# EAGLE design Spectrometer-Board (EAGLE 8.4.1)
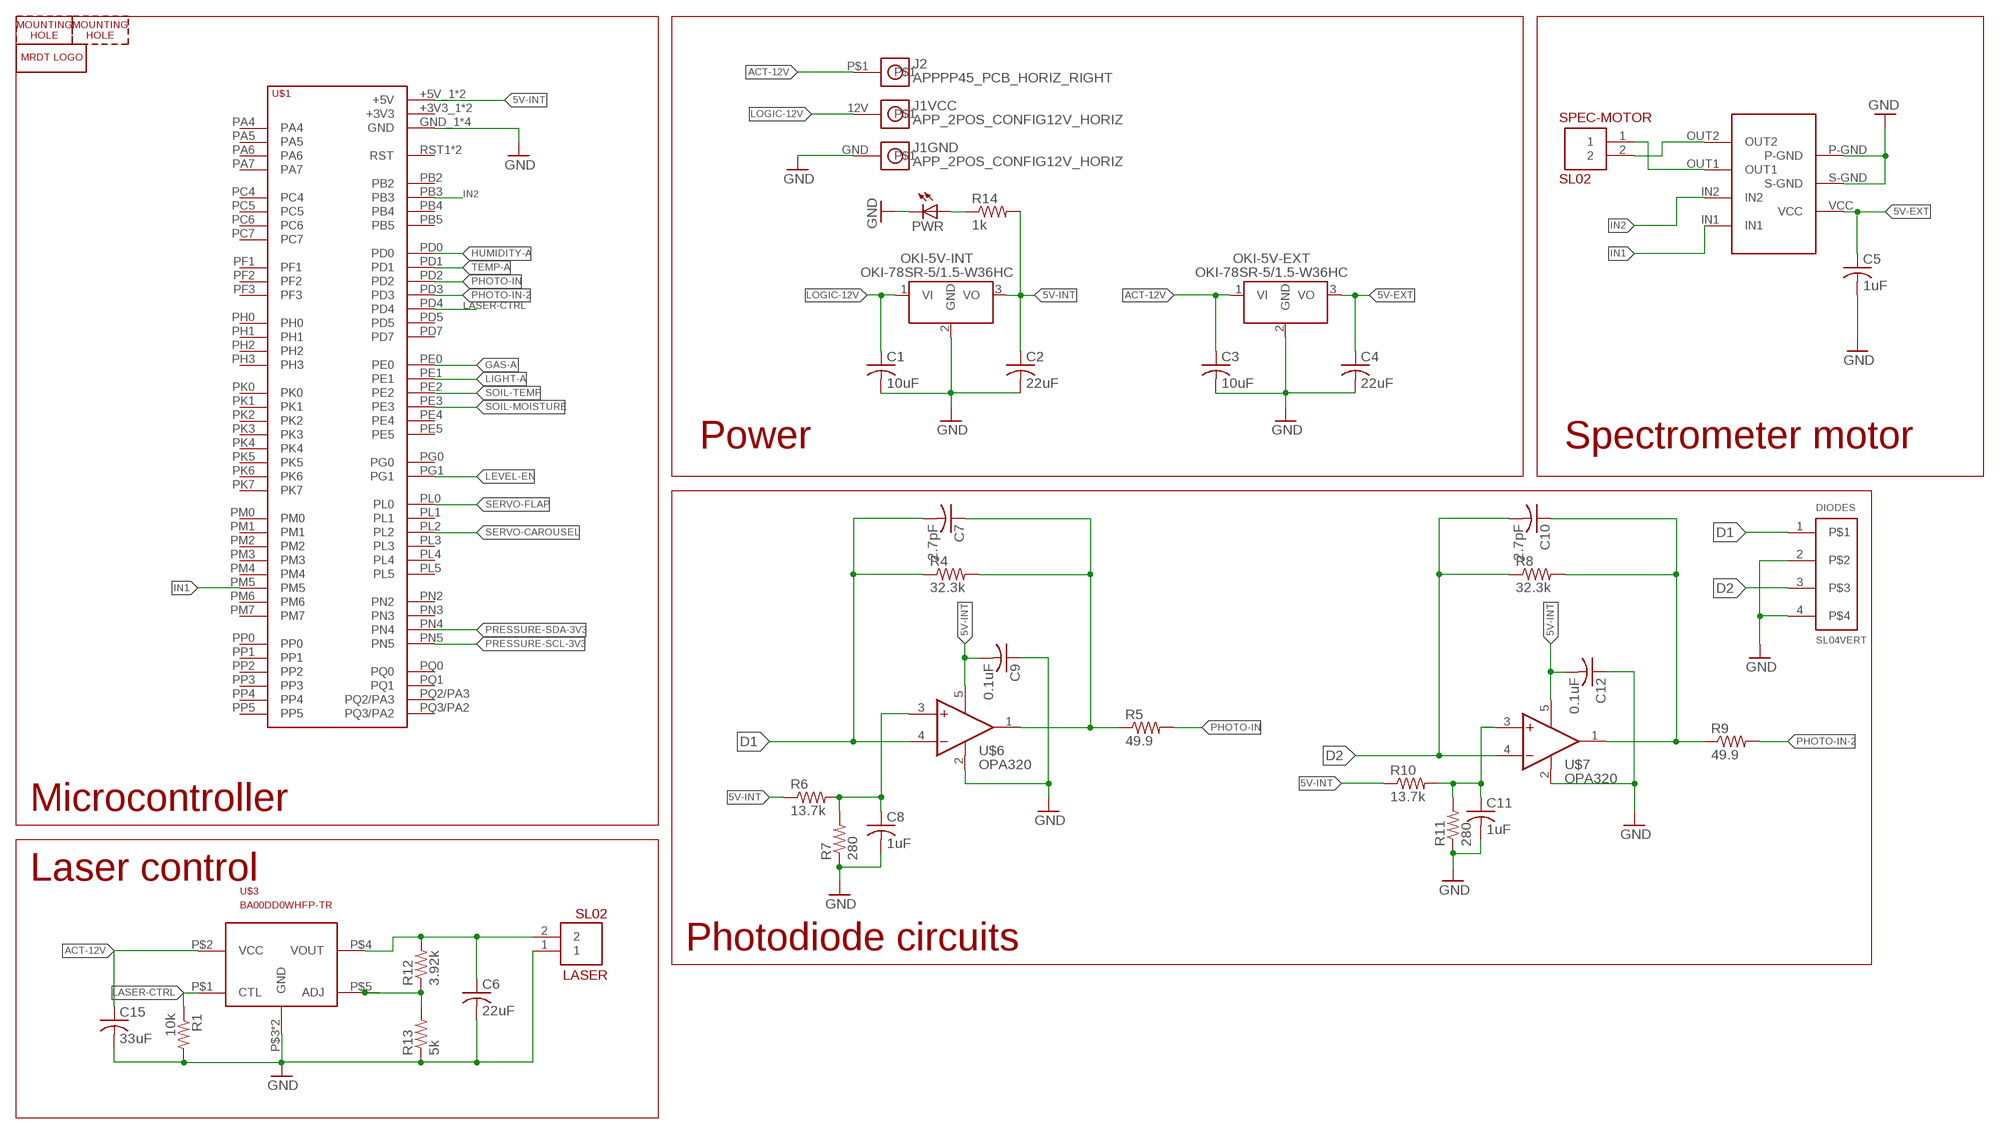
[diagram p0: schematic, sheet 1]

## Parts
C1  10uF  C-USC0805  [C0805]
C2  22uF  C-USC0805  [C0805]
C3  10uF  C-USC0805  [C0805]
C4  22uF  C-USC0805  [C0805]
C5  1uF  C-USC0805  [C0805]
C6  22uF  C-USC0805  [C0805]
C7  2.7pF  C-USC0805  [C0805]
C8  1uF  C-USC0805  [C0805]
C9  0.1uF  C-USC0805  [C0805]
C10  2.7pF  C-USC0805  [C0805]
C11  1uF  C-USC0805  [C0805]
C12  0.1uF  C-USC0805  [C0805]
C15  33uF  C-USC0805  [C0805]
DIODES  SL04VERT  [MOLEX-70543-0003]
H3  MOUNTING_HOLE#6  [#6_SCREW]
H4  MOUNTING_HOLE#6  [#6_SCREW]
J1  APP_2POS_CONFIG12V_HORIZ  [APP45_12V_HORIZ_CONFIG]
J2  APPPP45_PCB_HORIZ_RIGHT  [APP45_PCB_HORIZ_RIGHT]
LASER  SL02  [MOLEX-70543-0001]
LOGO1  MRDT_LOGO  [MRDT_LOGO]
OKI-5V-EXT  OKI-78SR-5/1.5-W36HC  [OKI-78SR_HORIZ]
OKI-5V-INT  OKI-78SR-5/1.5-W36HC  [OKI-78SR_HORIZ]
PWR  LEDCHIP-LED0805  [CHIP-LED0805]
R1  10k  R-US_M0805  [M0805]
R4  32.3k  R-US_M0805  [M0805]
R5  49.9  R-US_M0805  [M0805]
R6  13.7k  R-US_M0805  [M0805]
R7  280  R-US_M0805  [M0805]
R8  32.3k  R-US_M0805  [M0805]
R9  49.9  R-US_M0805  [M0805]
R10  13.7k  R-US_M0805  [M0805]
R11  280  R-US_M0805  [M0805]
R12  3.92k  R-US_M0805  [M0805]
R13  5k  R-US_M0805  [M0805]
R14  1k  R-US_M0805  [M0805]
SPEC-MOTOR  SL02  [MOLEX-70543-0001]
U$1  TIVA-1294  [TIVA-C-CONNECTED]
U$3  BA00DD0WHFP-TR  [TO-263-6]
U$6  OPA320  [SOT-23-5]
U$7  OPA320  [SOT-23-5]
U$10  LB1930MC  [SOIC10]

## Nets
5V-EXT: C4.1 C5.1 OKI-5V-EXT.3(VO) U$10.VCC
5V-INT: C2.1 C9.2 C12.2 OKI-5V-INT.3(VO) R6.1 R10.1 R14.2 U$1.+5V_1(+5V) U$1.+5V_2(+5V) U$6.5(OFF1) U$7.5(OFF1)
ACT-12V: C3.1 C15.1 J2.P$1 OKI-5V-EXT.1(VI) U$3.P$2(VCC)
D1: C7.2 DIODES.1 R4.1 U$6.4(-IN)
D2: C10.2 DIODES.3 R8.1 U$7.4(-IN)
GAS-A: U$1.PE0
GND: C1.2 C2.2 C3.2 C4.2 C5.2 C6.2 C8.2 C9.1 C11.2 C12.1 C15.2 DIODES.2 DIODES.4 J1.GND LASER.1 OKI-5V-EXT.2(GND) OKI-5V-INT.2(GND) PWR.C R1.2 R7.1 R11.1 R13.1 U$1.GND_1(GND) U$1.GND_2(GND) U$1.GND_3(GND) U$1.GND_4(GND) U$3.P$3(GND) U$3.P$6(GND) U$6.2(OFF2) U$7.2(OFF2) U$10.P-GND U$10.S-GND
HUMIDITY-A: U$1.PD0
IN1: U$1.PM5 U$10.IN1
IN2: U$1.PB3 U$10.IN2
LASER-CTRL: R1.1 U$1.PD4 U$3.P$1(CTL)
LEVEL-EN: U$1.PG1
LIGHT-A: U$1.PE1
LOGIC-12V: C1.1 J1.12V OKI-5V-INT.1(VI)
N$1: SPEC-MOTOR.2 U$10.OUT2
N$2: SPEC-MOTOR.1 U$10.OUT1
N$3: C6.1 LASER.2 R12.2 U$3.P$4(VOUT)
N$8: C7.1 R4.2 R5.1 U$6.1(OUT)
N$10: C8.1 R6.2 R7.2 U$6.3(+IN)
N$13: C10.1 R8.2 R9.1 U$7.1(OUT)
N$14: C11.1 R10.2 R11.2 U$7.3(+IN)
N$20: PWR.A R14.1
N$25: R12.1 R13.2 U$3.P$5(ADJ)
PHOTO-IN: R5.2 U$1.PD2
PHOTO-IN-2: R9.2 U$1.PD3
PRESSURE-SCL-3V3: U$1.PN5
PRESSURE-SDA-3V3: U$1.PN4
SERVO-CAROUSEL: U$1.PL2
SERVO-FLAP: U$1.PL0
SOIL-MOISTURE: U$1.PE3
SOIL-TEMP: U$1.PE2
TEMP-A: U$1.PD1
Unconnected: U$1.+3V3_1(+3V3) U$1.+3V3_2(+3V3) U$1.PA4 U$1.PA5 U$1.PA6 U$1.PA7 U$1.PB2 U$1.PB4 U$1.PB5 U$1.PC4 U$1.PC5 U$1.PC6 U$1.PC7 U$1.PD5 U$1.PD7 U$1.PE4 U$1.PE5 U$1.PF1 U$1.PF2 U$1.PF3 U$1.PG0 U$1.PH0 U$1.PH1 U$1.PH2 U$1.PH3 U$1.PK0 U$1.PK1 U$1.PK2 U$1.PK3 U$1.PK4 U$1.PK5 U$1.PK6 U$1.PK7 U$1.PL1 U$1.PL3 U$1.PL4 U$1.PL5 U$1.PM0 U$1.PM1 U$1.PM2 U$1.PM3 U$1.PM4 U$1.PM6 U$1.PM7 U$1.PN2 U$1.PN3 U$1.PP0 U$1.PP1 U$1.PP2 U$1.PP3 U$1.PP4 U$1.PP5 U$1.PQ0 U$1.PQ1 U$1.PQ2/PA3 U$1.PQ3/PA2 U$1.RST1(RST) U$1.RST_2(RST)

## Notes on the sheet
- Power | Spectrometer motor
- Microcontroller
- Laser control
- Photodiode circuits

## Library data of the parts
C1-C12 C15 = rcl:C-US: CAPACITOR, American symbol
DIODES = MRDT-Connectors:SL04
H3 H4 = MRDT-Hardware:MOUNTING_HOLE: Mounting hole for M6 bolt. Standard use mounting hole for: Tiva C Connected - M6 Anderson Powerpole Mounting Wing - M8 Most frame-mounted PCB's - M8
J1 = MRDT-Connectors:APP_2POS_CONFIG; COLOR1: YELLOW; COLOR2: BLACK
J2 = MRDT-Connectors:APP: http://www.powerwerx.com/anderson-powerpoles/
LASER SPEC-MOTOR = MRDT-Connectors:SL02
LOGO1 = MRDT-Hardware:MRDT_LOGO
OKI-5V-EXT OKI-5V-INT = MRDT-ICs:OKI-78SR-*/1.5-W36?C: 4.95W DC/DC Converter Manufacturer: Murata; VOUT: +5v
PWR = led:LED: LED OSRAM: - CHIPLED LG R971, LG N971, LY N971, LG Q971, LY Q971, LO R971, LY R971 LH N974, LH R974 LS Q976, LO Q976, LY Q976 LO Q996 - Hyper CHIPLED LW Q18S LB Q993, LB Q99A, LB R99A - SideLED LS A670, LO A670, LY A670, LG A670, LP A670 LB A673, LV A673, LT A673, LW A673 LH A674 LY A675 LS A676, LA A676, LO A676, LY A676, LW A676 LS A679, LY A679, LG A679 - Hyper Micro SIDELED® LS Y876, LA Y876, LO Y876, LY Y876 LT Y87S - SmartLED LW L88C, LW L88S LB L89C, LB L89S, LG L890 LS L89K, LO L89K, LY L89K LS L896, LA L896, LO L896, LY L896 - TOPLED LS T670, LO T670, LY T670, LG T670, LP T670 LSG T670, LSP T670, LSY T670, LOP T670, LYG T670 LG T671, LOG T671, LSG T671 LB T673, LV T673, LT T673, LW T673 LH T674 LS T676, LA T676, LO T676, LY T676, LB T676, LH T676, LSB T676, LW T676 LB T67C, LV T67C, LT T67C, LS T67K, LO T67K, LY T67K, LW E67C LS E67B, LA E67B, LO E67B, LY E67B, LB E67C, LV E67C, LT E67C LW T67C LS T679, LY T679, LG T679 LS T770, LO T770, LY T770, LG T770, LP T770 LB T773, LV T773, LT T773, LW T773 LH T774 LS E675, LA E675, LY E675, LS T675 LS T776, LA T776, LO T776, LY T776, LB T776 LHGB T686 LT T68C, LB T68C - Hyper Mini TOPLED® LB M676 - Mini TOPLED Santana® LG M470 LS M47K, LO M47K, LY M47K Source: http://www.osram.convergy.de LUXEON: - LUMILED® LXK2-PW12-R00, LXK2-PW12-S00, LXK2-PW14-U00, LXK2-PW14-V00 LXK2-PM12-R00, LXK2-PM12-S00, LXK2-PM14-U00 LXK2-PE12-Q00, LXK2-PE12-R00, LXK2-PE12-S00, LXK2-PE14-T00, LXK2-PE14-U00 LXK2-PB12-K00, LXK2-PB12-L00, LXK2-PB12-M00, LXK2-PB14-N00, LXK2-PB14-P00, LXK2-PB14-Q00 LXK2-PR12-L00, LXK2-PR12-M00, LXK2-PR14-Q00, LXK2-PR14-R00 LXK2-PD12-Q00, LXK2-PD12-R00, LXK2-PD12-S00 LXK2-PH12-R00, LXK2-PH12-S00 LXK2-PL12-P00, LXK2-PL12-Q00, LXK2-PL12-R00 Source: www.luxeon.com KINGBRIGHT: KA-3528ASYC Source: www.kingbright.com
R1 R4-R14 = rcl:R-US_: RESISTOR, American symbol
U$1 = MRDT-Microcontrollers:TIVA-1294: TIVA C CONNECTED LAUNCHPAD
U$3 = MRDT-ICs:BA00DD0WHFP-TR
U$6 U$7 = MRDT-ICs:OPA320
U$10 = Custom:LB1930MC

## Board
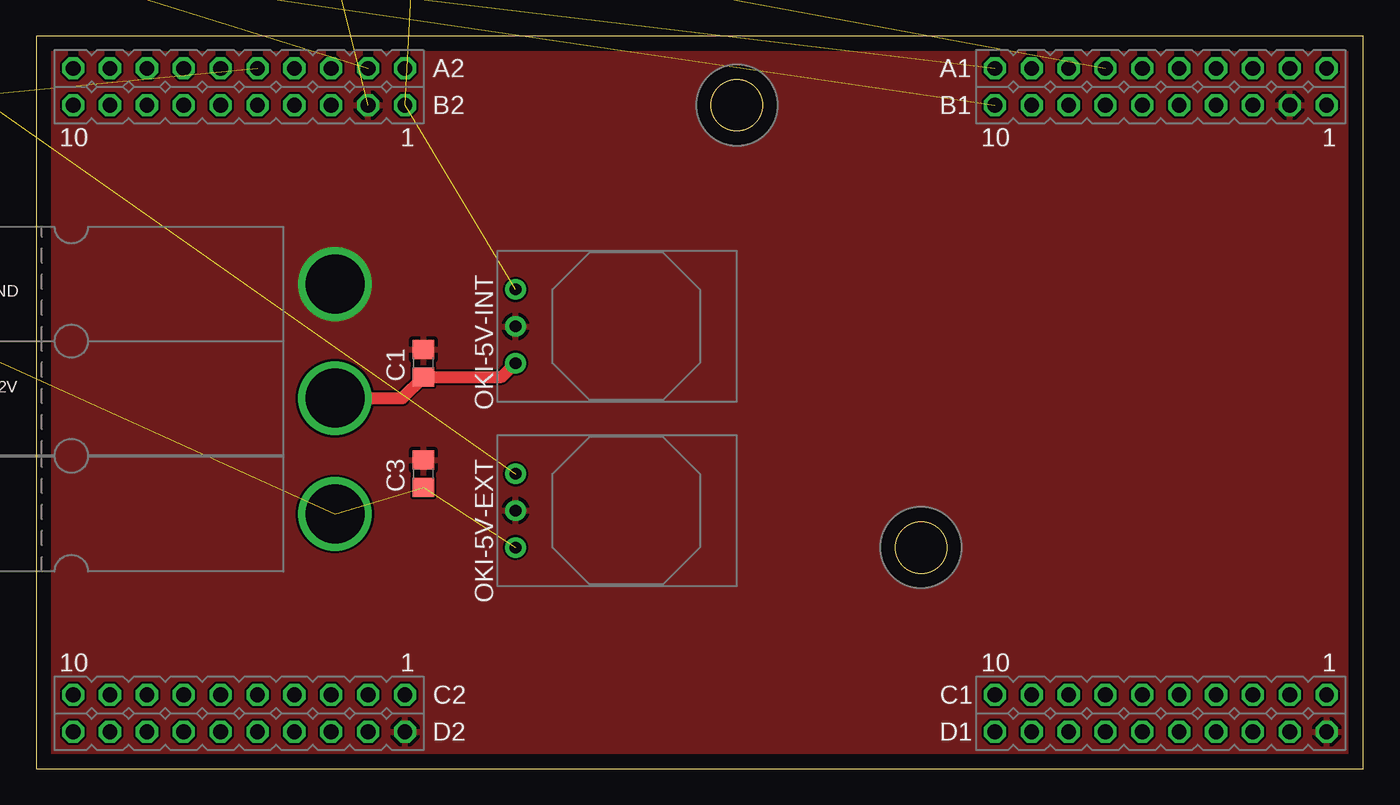
[diagram p1: board, top side]
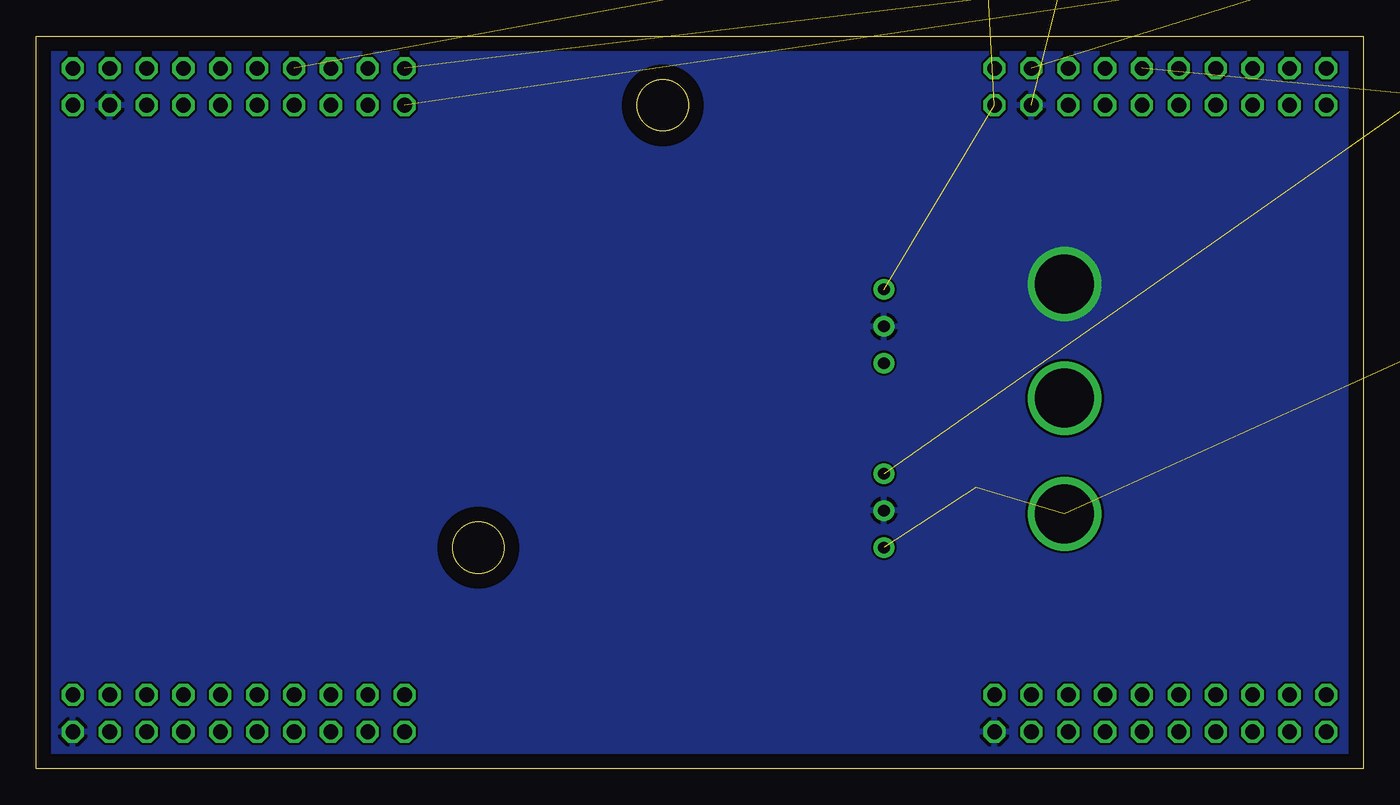
[diagram p2: board, bottom side, seen from below]

Size 91.42 x 50.47 mm. Coordinates in mm from the lower left corner, seen from the top.
Outline: 0,0 91.42,0 91.42,50.47 0,50.47 0,0
Copper layers (1*16): Top 0.035mm / dielectric 1.5mm / Bottom 0.035mm
Design rules "default": minimum track width 6mil, minimum drill 0.35mm, track to track 6mil, track to pad 6mil, pad to pad 6mil, via to via 6mil, smd to smd 6mil, copper to edge 40mil, drill to drill 6mil, minimum pad ring 10mil, minimum via ring 8mil, stop-mask expansion 4mil, vias tented up to drill 0mil, thermal gap 10mil

### Footprints (pad centres in the part's own frame; a part is rotated, then mirrored left to right if it is on the bottom)
C0805 = smd 1.3 x 1.5: 1 -0.95,0; 2 0.95,0
MOLEX-70543-0003 = drill 1.1 square: 1 3.81,0 | drill 1.1: 2 1.27,0; 3 -1.27,0; 4 -3.81,0
APP45_12V_HORIZ_CONFIG = drill 4.064: 12V 28.194,3.937; GND 28.194,11.811
APP45_PCB_HORIZ_RIGHT = drill 4.064: P$1 28.194,3.969
MOLEX-70543-0001 = drill 1.1 square: 1 1.27,0 | drill 1.1: 2 -1.27,0
OKI-78SR_HORIZ = drill 0.8 pad 1.422: 1 0,0; 2 -2.54,0; 3 -5.08,0
CHIP-LED0805 = smd 1.2 x 1.2: A 0,-1.05; C 0,1.05
M0805 = smd 1.3 x 1.6: 1 -0.95,0; 2 0.95,0
TIVA-C-CONNECTED = drill 1.016 octagon: +3V3_1 59.69,54.61; +3V3_2 123.19,54.61; +5V_1 59.69,52.07; +5V_2 123.19,52.07; GND_1 57.15,52.07; GND_2 59.69,8.89; GND_3 120.65,52.07; GND_4 123.19,8.89; PA4 39.37,52.07; PA5 36.83,52.07; PA6 105.41,52.07; PA7 52.07,8.89; PB2 102.87,54.61; PB3 100.33,54.61; PB4 54.61,52.07; PB5 52.07,52.07; PC4 118.11,54.61; PC5 115.57,54.61; PC6 113.03,54.61; PC7 105.41,54.61; PD0 107.95,8.89; PD1 110.49,8.89; PD2 57.15,54.61; PD3 107.95,54.61; PD4 49.53,54.61; PD5 46.99,54.61; PD7 107.95,52.07; PE0 118.11,52.07; PE1 115.57,52.07; PE2 113.03,52.07; PE3 110.49,52.07; PE4 120.65,54.61; PE5 110.49,54.61; PF1 123.19,11.43; PF2 120.65,11.43; PF3 118.11,11.43; PG0 115.57,11.43; PG1 59.69,11.43; PH0 44.45,11.43; PH1 41.91,11.43; PH2 118.11,8.89; PH3 115.57,8.89; PK0 49.53,52.07; PK1 46.99,52.07; PK2 44.45,52.07; PK3 41.91,52.07; PK4 57.15,11.43; PK5 54.61,11.43; PK6 39.37,11.43; PK7 36.83,11.43; PL0 107.95,11.43; PL1 105.41,11.43; PL2 102.87,11.43; PL3 100.33,11.43; PL4 113.03,11.43; PL5 110.49,11.43; PM0 52.07,11.43; PM1 49.53,11.43; PM2 46.99,11.43; PM3 120.65,8.89; PM4 102.87,52.07; PM5 100.33,52.07; PM6 36.83,8.89; PM7 57.15,8.89; PN2 105.41,8.89; PN3 102.87,8.89; PN4 36.83,54.61; PN5 39.37,54.61; PP0 54.61,54.61; PP1 52.07,54.61; PP2 100.33,8.89; PP3 41.91,8.89; PP4 41.91,54.61; PP5 54.61,8.89; PQ0 44.45,54.61; PQ1 39.37,8.89; PQ2/PA3 46.99,8.89; PQ3/PA2 44.45,8.89; RST1 49.53,8.89; RST_2 113.03,8.89
TO-263-6 = smd 1 x 2: P$1 -3.4,0; P$2 -1.7,0; P$3 0,0; P$4 1.7,0; P$5 3.4,0 | smd 10 x 9: P$6 0,7
SOT-23-5 = smd 0.62 x 1.22: 1 -0.95,-1.3; 2 0,-1.3; 3 0.95,-1.3; 4 0.95,1.3; 5 -0.95,1.3
SOIC10 = smd 1.27 x 0.635: IN1 -0.6,2.45; IN2 -0.6,1.55; NC1 4.5,4.3; NC2 -0.6,3.35; NC3 4.5,2.45; OUT1 4.5,3.35; OUT2 4.5,1.55; P-GND 4.5,0.6; S-GND -0.6,0.6; VCC -0.6,4.3

### Placement (x,y rotation side)
C1  26.67,27.94 90 top
C2  -29.21,73.66 0 top  (outside the outline)
C3  26.67,20.32 90 top
C4  -41.91,73.66 0 top  (outside the outline)
C5  -90.17,73.66 0 top  (outside the outline)
C6  -48.26,73.66 0 top  (outside the outline)
C7  -83.82,63.5 0 top  (outside the outline)
C8  -95.25,73.66 0 top  (outside the outline)
C9  -90.17,63.5 0 top  (outside the outline)
C10  -96.52,63.5 0 top  (outside the outline)
C11  -69.85,73.66 0 top  (outside the outline)
C12  -102.87,63.5 0 top  (outside the outline)
C15  -54.61,73.66 0 top  (outside the outline)
DIODES  15.24,71.12 0 top  (outside the outline)
H3  48.26,45.72 0 top
H4  60.96,15.24 0 top
J1  -7.62,21.59 0 top
J2  -7.62,13.59 0 top
LASER  -123.19,72.39 0 top  (outside the outline)
LOGO1  96.52,0 0 top  (outside the outline)
OKI-5V-EXT  33.02,15.24 270 top
OKI-5V-INT  33.02,27.94 270 top
PWR  -109.22,72.39 0 top  (outside the outline)
R1  -105.41,73.66 0 top  (outside the outline)
R4  -109.22,63.5 0 top  (outside the outline)
R5  -59.69,73.66 0 top  (outside the outline)
R6  -115.57,63.5 0 top  (outside the outline)
R7  -100.33,73.66 0 top  (outside the outline)
R8  -121.92,63.5 0 top  (outside the outline)
R9  -64.77,73.66 0 top  (outside the outline)
R10  -128.27,63.5 0 top  (outside the outline)
R11  -74.93,73.66 0 top  (outside the outline)
R12  -16.51,73.66 0 top  (outside the outline)
R13  -80.01,73.66 0 top  (outside the outline)
R14  -85.09,73.66 0 top  (outside the outline)
SPEC-MOTOR  -106.68,21.59 0 top  (outside the outline)
U$1  -34.29,-6.35 0 top
U$3  -34.29,43.18 0 top  (outside the outline)
U$6  36.83,74.93 0 top  (outside the outline)
U$7  27.94,73.66 0 top  (outside the outline)
U$10  -62.23,62.23 0 top  (outside the outline)

### Tracks (layer width: path | path; a pad name or v marks a point on that pad's centre or on a via)
5V-EXT  (3 unrouted)
5V-INT  (9 unrouted)
ACT-12V  (4 unrouted)
D1  (3 unrouted)
D2  (3 unrouted)
GND  (23 unrouted)
  pour Top: -2.54,52.07 -2.54,-1.27 92.71,-1.27 92.71,52.07
  pour Bottom: -3.81,53.34 -3.81,-2.54 93.98,-2.54 93.98,53.34
IN1  (1 unrouted)
IN2  (1 unrouted)
LASER-CTRL  (2 unrouted)
LOGIC-12V
  Top 0.813: J1.12V 25.21,25.53 C1.1 32.07,26.99 OKI-5V-INT.1
N$1  (1 unrouted)
N$2  (1 unrouted)
N$3  (3 unrouted)
N$8  (3 unrouted)
N$10  (3 unrouted)
N$13  (3 unrouted)
N$14  (3 unrouted)
N$20  (1 unrouted)
N$25  (2 unrouted)
PHOTO-IN  (1 unrouted)
PHOTO-IN-2  (1 unrouted)